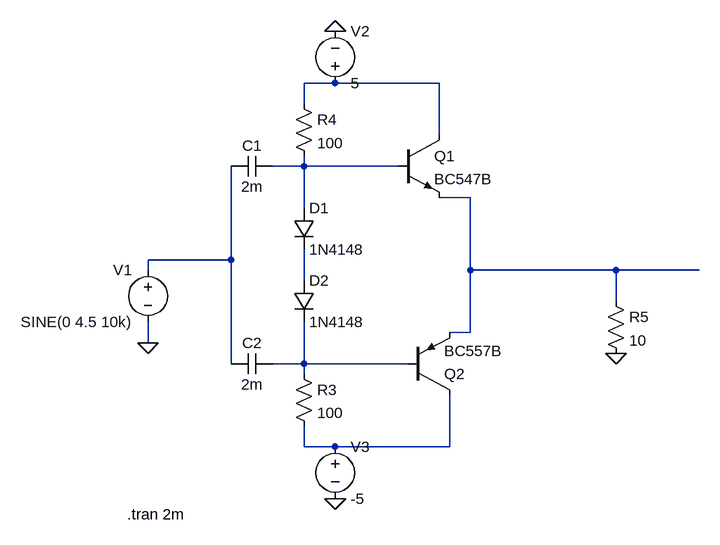
[diagram p0: schematic power_amplifier.asc]
power_amplifier.asc, the LTspice schematic file:
Version 4
SHEET 1 880 680
WIRE 192 -80 144 -80
WIRE 352 -80 192 -80
WIRE 144 -48 144 -80
WIRE 352 0 352 -80
WIRE 144 48 144 32
WIRE 144 48 96 48
WIRE 288 48 144 48
WIRE 400 96 352 96
WIRE 144 112 144 48
WIRE 32 192 32 48
WIRE 32 192 -96 192
WIRE -96 208 -96 192
WIRE 400 208 400 96
WIRE 624 208 400 208
WIRE 752 208 624 208
WIRE 144 224 144 176
WIRE 624 256 624 208
WIRE 400 304 400 208
WIRE 400 304 368 304
WIRE -96 320 -96 288
WIRE 32 352 32 192
WIRE 144 352 144 288
WIRE 144 352 96 352
WIRE 304 352 144 352
WIRE 144 368 144 352
WIRE 144 480 144 448
WIRE 192 480 144 480
WIRE 368 480 368 400
WIRE 368 480 192 480
FLAG 192 560 0
FLAG 192 -160 0
FLAG -96 320 0
FLAG 624 336 0
SYMBOL diode 128 112 R0
SYMATTR InstName D1
SYMATTR Value 1N4148
SYMBOL diode 128 224 R0
SYMATTR InstName D2
SYMATTR Value 1N4148
SYMBOL npn 288 0 R0
SYMATTR InstName Q1
SYMATTR Value BC547B
SYMBOL pnp 304 400 M180
SYMATTR InstName Q2
SYMATTR Value BC557B
SYMBOL res 128 352 R0
SYMATTR InstName R3
SYMATTR Value 100
SYMBOL res 128 -64 R0
SYMATTR InstName R4
SYMATTR Value 100
SYMBOL voltage -96 192 M0
WINDOW 123 0 0 Left 0
WINDOW 39 0 0 Left 0
SYMATTR InstName V1
SYMATTR Value SINE(0 4.5 10k)
SYMBOL voltage 192 -64 M180
WINDOW 0 24 96 Left 2
WINDOW 3 24 16 Left 2
WINDOW 123 0 0 Left 0
WINDOW 39 0 0 Left 0
SYMATTR InstName V2
SYMATTR Value 5
SYMBOL voltage 192 464 R0
WINDOW 123 0 0 Left 0
WINDOW 39 0 0 Left 0
SYMATTR InstName V3
SYMATTR Value -5
SYMBOL res 608 240 R0
SYMATTR InstName R5
SYMATTR Value 10
SYMBOL cap 96 32 R90
WINDOW 0 0 32 VBottom 2
WINDOW 3 32 32 VTop 2
SYMATTR InstName C1
SYMATTR Value 2m
SYMBOL cap 96 336 R90
WINDOW 0 0 32 VBottom 2
WINDOW 3 32 32 VTop 2
SYMATTR InstName C2
SYMATTR Value 2m
TEXT -128 584 Left 2 !.tran 2m

The netlist it stands for:
* power_amplifier.asc
D1 N002 N005 1N4148
D2 N005 N006 1N4148
Q1 N001 N002 N003 0 BC547B
Q2 N007 N006 N003 0 BC557B
R3 N006 N007 100
R4 N001 N002 100
V1 N004 0 SINE(0 4.5 10k)
V2 N001 0 5
V3 N007 0 -5
R5 N003 0 10
C1 N002 N004 2m
C2 N006 N004 2m
.model D D
.lib standard.dio
.model NPN NPN
.model PNP PNP
.lib standard.bjt
.tran 2m
.backanno
.end